# Altium project Arrow-ESC.PrjPcb
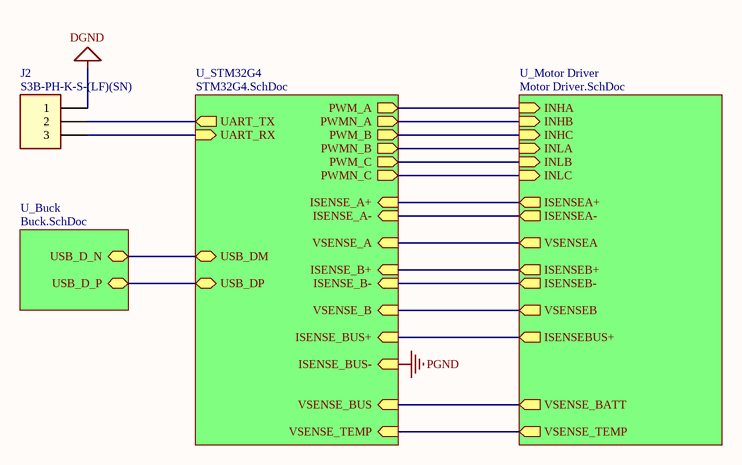
[diagram p0: Top Level.SchDoc]
4 sheets, 104 parts. Net scope: hierarchical (ports join the sheet entries above them; power ports are global).
Board file: Arrow-ESC.PcbDoc
Sheets:
  Top Level.SchDoc
    U_STM32G4 = STM32G4.SchDoc
    U_Buck = Buck.SchDoc
    U_Motor Driver = Motor Driver.SchDoc

## Sheet Top Level.SchDoc
size A; SheetNumber: 1; SheetTotal: 4

### Parts
J2  S3B-PH-K-S-(LF)(SN)  [CONN-TH_3P-P2.00_S3B-PH-K-S-LF-SN]

### Sub-sheets
U_Buck = Buck.SchDoc: USB_D_P (bidir), USB_D_N (bidir)
U_Motor Driver = Motor Driver.SchDoc: INHA (in), INHB (in), INHC (in), INLA (in), INLB (in), INLC (in), VSENSE_TEMP (out), ISENSEA+ (out), ISENSEA- (out), ISENSEB+ (out), ISENSEB- (out), VSENSEA (out), VSENSEB (out), VSENSE_BATT (out), ISENSEBUS+ (out)
U_STM32G4 = STM32G4.SchDoc: ISENSE_A+ (in), ISENSE_A- (in), ISENSE_B+ (in), ISENSE_B- (in), ISENSE_BUS+ (in), VSENSE_A (in), VSENSE_B (in), VSENSE_BUS (in), VSENSE_TEMP (in), UART_TX (out), UART_RX (in), USB_DP (bidir), USB_DM (bidir), PWM_A (out), PWMN_A (out), PWM_B (out), PWMN_B (out), PWM_C (out), PWMN_C (out), ISENSE_BUS- (in)

### Nets
DGND: J2.1
ADC1_IN10: sheet U_STM32G4/VSENSE_A, sheet U_Motor Driver/VSENSEA
ADC1_IN14: sheet U_STM32G4/VSENSE_BUS, sheet U_Motor Driver/VSENSE_BATT
ADC2_IN12: sheet U_STM32G4/VSENSE_B, sheet U_Motor Driver/VSENSEB
ADC2_IN17: sheet U_STM32G4/VSENSE_TEMP, sheet U_Motor Driver/VSENSE_TEMP
TIM1_CH1: sheet U_STM32G4/PWM_A, sheet U_Motor Driver/INHA
TIM1_CH1N: sheet U_STM32G4/PWMN_A, sheet U_Motor Driver/INHB
TIM1_CH2: sheet U_STM32G4/PWM_B, sheet U_Motor Driver/INHC
TIM1_CH2N: sheet U_STM32G4/PWMN_B, sheet U_Motor Driver/INLA
TIM1_CH3: sheet U_STM32G4/PWM_C, sheet U_Motor Driver/INLB
TIM1_CH3N: sheet U_STM32G4/PWMN_C, sheet U_Motor Driver/INLC
USART1_RX: J2.3 ; sheet U_STM32G4/UART_RX
USART1_TX: J2.2 ; sheet U_STM32G4/UART_TX
USB_D_N: sheet U_STM32G4/USB_DM, sheet U_Buck/USB_D_N
USB_D_P: sheet U_STM32G4/USB_DP, sheet U_Buck/USB_D_P
NetQ4_1: sheet U_STM32G4/ISENSE_A+, sheet U_Motor Driver/ISENSEA+
NetQ5_1: sheet U_STM32G4/ISENSE_B+, sheet U_Motor Driver/ISENSEB+
NetQ6_1: sheet U_STM32G4/ISENSE_A-, sheet U_STM32G4/ISENSE_B-, sheet U_STM32G4/ISENSE_BUS+, sheet U_Motor Driver/ISENSEA-, sheet U_Motor Driver/ISENSEB-, sheet U_Motor Driver/ISENSEBUS+

### Library data of the parts
J2 = S3B-PH-K-S-(LF)(SN): 3P 1x3P PH Tin -25℃~+85℃ White 2mm 100V 3 2A 1 Right Angle Through Hole,Right Angle,P=2mm Headers, Male Pins RoHS; Manu Part #: S3B-PH-K-S-(LF)(SN); LCSC Part #: C157929

## Sheet STM32G4.SchDoc
size B; SheetNumber: 2; SheetTotal: 4
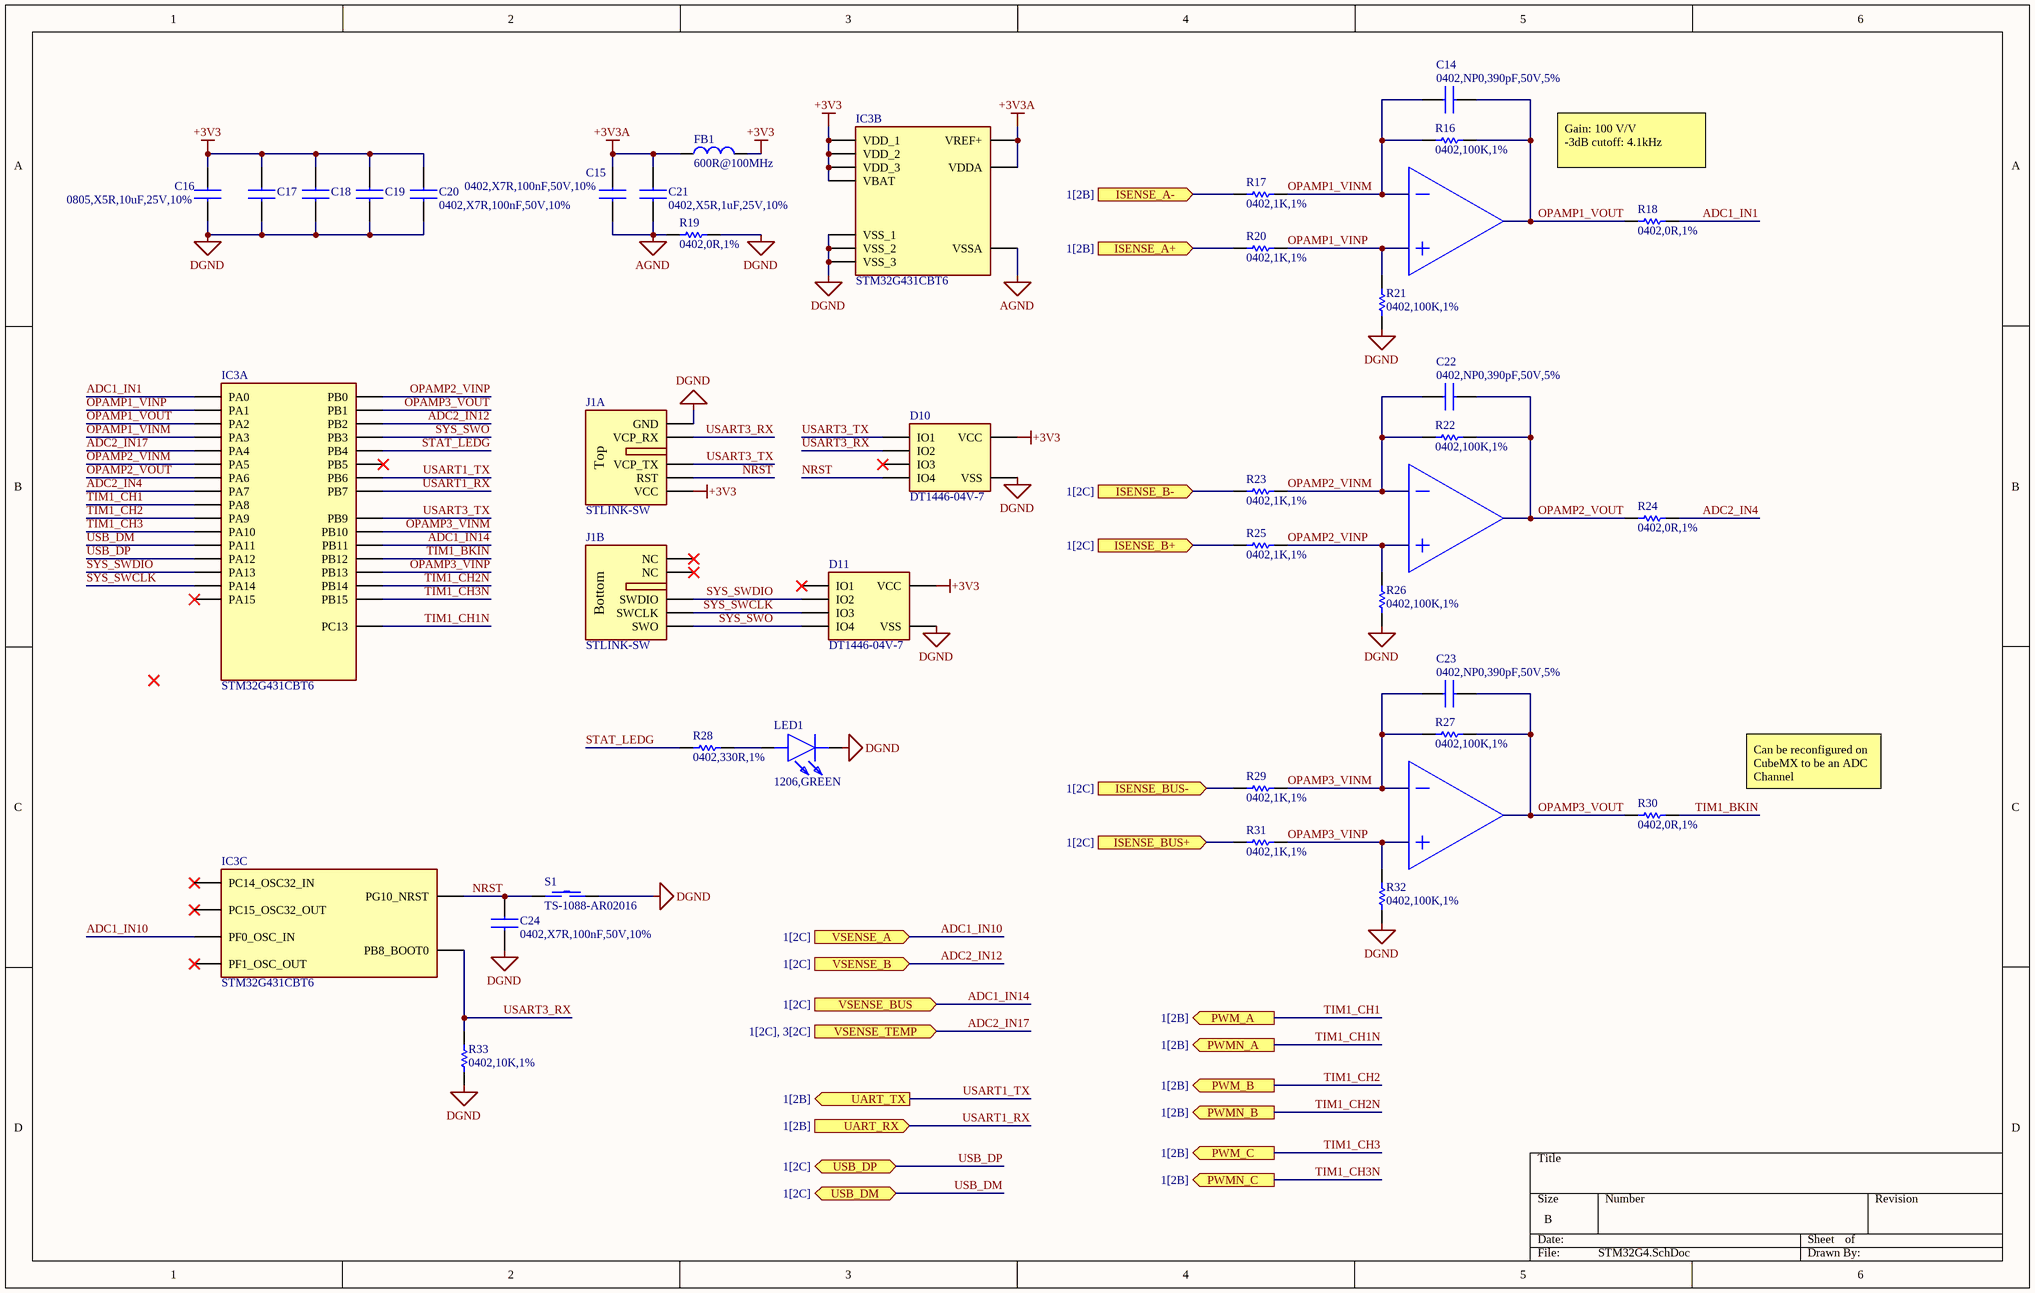
[diagram p1: STM32G4.SchDoc]

### Parts
C14  0402,NP0,390pF,50V,5%  [CAPC1005X55N]
C15  0402,X7R,100nF,50V,10%  [CAPC1005X55N]
C16  0805,X5R,10uF,25V,10%  [CAPC2012X145N]
C17  0402,X7R,100nF,50V,10%  [CAPC1005X55N]  (value not drawn)
C18  0402,X7R,100nF,50V,10%  [CAPC1005X55N]  (value not drawn)
C19  0402,X7R,100nF,50V,10%  [CAPC1005X55N]  (value not drawn)
C20  0402,X7R,100nF,50V,10%  [CAPC1005X55N]
C21  0402,X5R,1uF,25V,10%  [CAPC1005X55N]
C22  0402,NP0,390pF,50V,5%  [CAPC1005X55N]
C23  0402,NP0,390pF,50V,5%  [CAPC1005X55N]
C24  0402,X7R,100nF,50V,10%  [CAPC1005X55N]
D10  DT1446-04V-7  [SOTFL50P162X60-6N]
D11  DT1446-04V-7  [SOTFL50P162X60-6N]
FB1  600R@100MHz  [L0603]
IC3  STM32G431CBT6  [QFP50P900X900X160-48N]  (parts A,B,C of 3)
J1  STLINK-SW  [009159010061911]  (parts A,B of 2)  (no BOM)
LED1  1206,GREEN  [LEDC3216X120N]
R16  0402,100K,1%  [RESC1005X40N]
R17  0402,1K,1%  [RESC1005X40N]
R18  0402,0R,1%  [RESC1005X40N]
R19  0402,0R,1%  [RESC1005X40N]
R20  0402,1K,1%  [RESC1005X40N]
R21  0402,100K,1%  [RESC1005X40N]
R22  0402,100K,1%  [RESC1005X40N]
R23  0402,1K,1%  [RESC1005X40N]
R24  0402,0R,1%  [RESC1005X40N]
R25  0402,1K,1%  [RESC1005X40N]
R26  0402,100K,1%  [RESC1005X40N]
R27  0402,100K,1%  [RESC1005X40N]
R28  0402,330R,1%  [RESC1005X40N]
R29  0402,1K,1%  [RESC1005X40N]
R30  0402,0R,1%  [RESC1005X40N]
R31  0402,1K,1%  [RESC1005X40N]
R32  0402,100K,1%  [RESC1005X40N]
R33  0402,10K,1%  [RESC1005X40N]
S1  TS-1088-AR02016  [SW-SMD_L3.9-W3.0-P4.45]

### Ports
ISENSE_A+ (in, see 1[2B]), ISENSE_A- (in, see 1[2B]), ISENSE_B+ (in, see 1[2C]), ISENSE_B- (in, see 1[2C]), ISENSE_BUS+ (in, see 1[2C]), ISENSE_BUS- (in, see 1[2C]), PWM_A (out, see 1[2B]), PWM_B (out, see 1[2B]), PWM_C (out, see 1[2B]), PWMN_A (out, see 1[2B]), PWMN_B (out, see 1[2B]), PWMN_C (out, see 1[2B]), UART_RX (in, see 1[2B]), UART_TX (out, see 1[2B]), USB_DM (bidir, see 1[2C]), USB_DP (bidir, see 1[2C]), VSENSE_A (in, see 1[2C]), VSENSE_B (in, see 1[2C]), VSENSE_BUS (in, see 1[2C]), VSENSE_TEMP (in, see 1[2C], 3[2C])

### Nets
+3V3: C16.2 C17.2 C18.2 C19.2 C20.2 D10.5(VCC) D11.5(VCC) FB1.2 IC3.1(VBAT) IC3.24(VDD_1) IC3.36(VDD_2) IC3.48(VDD_3) J1.5(VCC)
+3V3A: C15.2 C21.2 FB1.1 IC3.20(VREF+) IC3.21(VDDA)
AGND: C15.1 C21.1 IC3.19(VSSA) R19.1
DGND: C16.1 C17.1 C18.1 C19.1 C20.1 C24.1 D10.2(VSS) D11.2(VSS) IC3.23(VSS_1) IC3.35(VSS_2) IC3.47(VSS_3) J1.1(GND) LED1.1(K) R19.2 R21.1 R26.1 R32.1 R33.1 S1.1
PGND: R29.1 ; port ISENSE_BUS-
ADC1_IN1: IC3.8(PA0) R18.2
ADC1_IN10: IC3.5(PF0_OSC_IN) ; port VSENSE_A
ADC1_IN14: IC3.25(PB11) ; port VSENSE_BUS
ADC2_IN4: IC3.15(PA7) R24.2
ADC2_IN12: IC3.18(PB2) ; port VSENSE_B
ADC2_IN17: IC3.12(PA4) ; port VSENSE_TEMP
NRST: C24.2 D10.6(IO4) IC3.7(PG10_NRST) J1.4(RST) S1.2
OPAMP1_VINM: C14.1 IC3.11(PA3) R16.2 R17.2
OPAMP1_VINP: IC3.9(PA1) R20.2 R21.2
OPAMP1_VOUT: C14.2 IC3.10(PA2) R16.1 R18.1
OPAMP2_VINM: C22.1 IC3.13(PA5) R22.2 R23.2
OPAMP2_VINP: IC3.16(PB0) R25.2 R26.2
OPAMP2_VOUT: C22.2 IC3.14(PA6) R22.1 R24.1
OPAMP3_VINM: C23.1 IC3.22(PB10) R27.1 R29.2
OPAMP3_VINP: IC3.27(PB13) R31.2 R32.2
OPAMP3_VOUT: C23.2 IC3.17(PB1) R27.2 R30.1
STAT_LEDG: IC3.41(PB4) R28.1
SYS_SWCLK: D11.4(IO3) IC3.38(PA14) J1.9(SWCLK)
SYS_SWDIO: D11.3(IO2) IC3.37(PA13) J1.8(SWDIO)
SYS_SWO: D11.6(IO4) IC3.40(PB3) J1.10(SWO)
TIM1_BKIN: IC3.26(PB12) R30.2
TIM1_CH1: IC3.30(PA8) ; port PWM_A
TIM1_CH1N: IC3.2(PC13) ; port PWMN_A
TIM1_CH2: IC3.31(PA9) ; port PWM_B
TIM1_CH2N: IC3.28(PB14) ; port PWMN_B
TIM1_CH3: IC3.32(PA10) ; port PWM_C
TIM1_CH3N: IC3.29(PB15) ; port PWMN_C
USART1_RX: IC3.44(PB7) ; port UART_RX
USART1_TX: IC3.43(PB6) ; port UART_TX
USART3_RX: D10.3(IO2) IC3.45(PB8_BOOT0) J1.2(VCP_RX) R33.2
USART3_TX: D10.1(IO1) IC3.46(PB9) J1.3(VCP_TX)
USB_DM: IC3.33(PA11) ; port USB_DM  [project net USB_D_N]
USB_DP: IC3.34(PA12) ; port USB_DP  [project net USB_D_P]
NetLED1_2: LED1.2(A) R28.2
NetQ4_1: R20.1 ; port ISENSE_A+
NetQ5_1: R25.1 ; port ISENSE_B+
NetQ6_1: R17.1 R23.1 R31.1 ; port ISENSE_A-, port ISENSE_B-, port ISENSE_BUS+

Not connected (* = marked no-connect by the designer): D10 4(IO3)*; D11 1(IO1)*; IC3 3(PC14_OSC32_IN)* 4(PC15_OSC32_OUT)* 6(PF1_OSC_OUT)* 39(PA15)* 42(PB5)*; J1 6(NC)* 7(NC)*

### Notes on the sheet
- Gain: 100 V/V
  -3dB cutoff: 4.1kHz
- Can be reconfigured on CubeMX to be an ADC Channel
- (in symbol STLINK-SW, part A) Top
- (in symbol STLINK-SW, part B) Bottom

### Library data of the parts
C14 C22 C23 = CC0402JRNPO9BN391: 390 pF ±5% 50V Ceramic Capacitor C0G, NP0 0402 (1005 Metric); Manufacturer_Name: YAGEO; Manufacturer_Part_Number: CC0402KRX7R9BB104; Datasheet Link: https://4donline.ihs.com/images/VipMasterIC/IC/YAGO/YAGO-S-A0003557223/YAGO-S-A0003557223-1.pdf?hkey=6D3A4C79FDBF58556ACFDE234799DDF0; Height: 0.55mm; Mouser Part Number: 603-CC402KRX7R9BB104; Mouser Price/Stock: https://www.mouser.co.uk/ProductDetail/YAGEO/CC0402KRX7R9BB104?qs=vRUrOTOuwyGrQb4GbTIVjw%3D%3D; Arrow Part Number: CC0402KRX7R9BB104; Arrow Price/Stock: https://www.arrow.com/en/products/cc0402krx7r9bb104/yageo?utm_currency=USD&region=europe; Manu Part #: CC0402JRNPO9BN391; LCSC Part #: C282239
C15 C17-C20 C24 = CC0402KRX7R9BB104: 0.1 µF ±10% 50V Ceramic Capacitor X7R 0402 (1005 Metric); Manufacturer_Name: YAGEO; Datasheet Link: https://4donline.ihs.com/images/VipMasterIC/IC/YAGO/YAGO-S-A0003557223/YAGO-S-A0003557223-1.pdf?hkey=6D3A4C79FDBF58556ACFDE234799DDF0; Height: 0.55mm; Manufacturer_Part_Number: CC0402KRX7R9BB104; Mouser Part Number: 603-CC402KRX7R9BB104; Mouser Price/Stock: https://www.mouser.co.uk/ProductDetail/YAGEO/CC0402KRX7R9BB104?qs=vRUrOTOuwyGrQb4GbTIVjw%3D%3D; Arrow Part Number: CC0402KRX7R9BB104; Arrow Price/Stock: https://www.arrow.com/en/products/cc0402krx7r9bb104/yageo?utm_currency=USD&region=europe; Manu Part #: CC0402KRX7R9BB104; LCSC Part #: C131394
C16 = CC0805KKX5R8BB106: 10 µF ±10% 25V Ceramic Capacitor X5R 0805 (2012 Metric); Manufacturer_Name: YAGEO; Datasheet Link: https://www.yageo.com/upload/media/product/productsearch/datasheet/mlcc/UPY-GPHC_X5R_4V-to-50V_27.pdf; Height: 1.45mm; Manufacturer_Part_Number: CC0805KKX5R8BB106; Mouser Part Number: 603-CC805KKX5R8BB106; Mouser Price/Stock: https://www.mouser.co.uk/ProductDetail/YAGEO/CC0805KKX5R8BB106?qs=57cj7OiSijm89pM64t1AGQ%3D%3D; Arrow Part Number: CC0805KKX5R8BB106; Arrow Price/Stock: https://www.arrow.com/en/products/cc0805kkx5r8bb106/yageo?utm_currency=USD&region=nac; LCSC Part #: C89831
C21 = CC0402KRX5R8BB105: 1 µF ±10% 25V Ceramic Capacitor X5R 0402 (1005 Metric); Manufacturer_Name: YAGEO; Manufacturer_Part_Number: CC0402KRX7R9BB104; Datasheet Link: https://4donline.ihs.com/images/VipMasterIC/IC/YAGO/YAGO-S-A0003557223/YAGO-S-A0003557223-1.pdf?hkey=6D3A4C79FDBF58556ACFDE234799DDF0; Height: 0.55mm; Mouser Part Number: 603-CC402KRX7R9BB104; Mouser Price/Stock: https://www.mouser.co.uk/ProductDetail/YAGEO/CC0402KRX7R9BB104?qs=vRUrOTOuwyGrQb4GbTIVjw%3D%3D; Arrow Part Number: CC0402KRX7R9BB104; Arrow Price/Stock: https://www.arrow.com/en/products/cc0402krx7r9bb104/yageo?utm_currency=USD&region=europe; Manu Part #: CC0402KRX5R8BB105; LCSC Part #: C326568
D10 D11 = DT1446-04V-7: 8.5V Clamp 4.7A (8/20µs) Ipp Tvs Diode Surface Mount SOT-563; Manufacturer_Name: Diodes Incorporated; Datasheet Link: https://www.diodes.com//assets/Datasheets/DT1446-04V.pdf; Height: 0.6mm; Manufacturer_Part_Number: DT1446-04V-7; Mouser Part Number: 621-DT1446-04V-7; Mouser Price/Stock: https://www.mouser.co.uk/ProductDetail/Diodes-Incorporated/DT1446-04V-7?qs=5V6w%252Be2aIqaQkUd2yRdmdA%3D%3D; Arrow Part Number: DT1446-04V-7; Arrow Price/Stock: https://www.arrow.com/en/products/dt1446-04v-7/diodes-incorporated; Manu Part #: DT1446-04V-7; LCSC Part #: C460066
FB1 = BLM18AG601SN1D: 380mΩ ±25% 600Ω@100MHz 0603 Ferrite Beads ROHS; LCSC Part #: C19330
IC3 = STM32G431CBT6: Arm Cortex-M4 32-bit MCU+FPU, 170 MHz / 213 DMIPS, up to 128 KB Flash, 32 KB SRAM, rich analog, math accelerator; Manufacturer_Name: STMicroelectronics; Datasheet Link: https://www.st.com/resource/en/datasheet/stm32g431cb.pdf; Height: 1.6mm; Manufacturer_Part_Number: STM32G431CBT6; Mouser Part Number: 511-STM32G431CBT6; Mouser Price/Stock: https://www.mouser.co.uk/ProductDetail/STMicroelectronics/STM32G431CBT6?qs=T3oQrply3y8OocyGDXq5wg%3D%3D; Arrow Part Number: STM32G431CBT6; Arrow Price/Stock: https://www.arrow.com/en/products/stm32g431cbt6/stmicroelectronics?utm_currency=USD&region=nac; LCSC Part #: C529355
J1 = STLINK-SW: SSL Connector 10 Position Adapter, Bridge Board to Board - Card Edge 0.079" (2.00mm)
LED1 = LTST-C150KGKT: 20mA 44.5mcd Water Clear -55℃~+85℃ 571nm Yellow Green 130° 75mW 2V 1206 LED Indication - Discrete ROHS; Manufacturer_Name: Lite-On; Datasheet Link: http://optoelectronics.liteon.com/upload/download/ds22-2000-072/ltst-c150kgkt.pdf; Height: 1.2mm; Manufacturer_Part_Number: LTST-C150KGKT; Mouser Part Number: 859-LTST-C150KGKT; Mouser Price/Stock: https://www.mouser.co.uk/ProductDetail/Lite-On/LTST-C150KGKT?qs=G7lFeYdtIHB%2FzaFKBwEyXw%3D%3D; Arrow Part Number: LTST-C150KGKT; Arrow Price/Stock: https://www.arrow.com/en/products/ltst-c150kgkt/lite-on-technology?utm_currency=USD&region=nac; LCSC Part #: C125085; Manu Part #: LTST-C150KGKT
R16 R21 R22 R26 R27 R32 = RC0402FR-07100KL: 100 kOhms ±1% 0.063W, 1/16W Chip Resistor 0402 (1005 Metric) Moisture Resistant Thick Film; Manufacturer_Name: YAGEO; Manufacturer_Part_Number: RC0402FR-0710KL; Datasheet Link: https://componentsearchengine.com/Datasheets/2/RC0402FR-0710KL.pdf; Height: 0.4mm; Mouser Part Number: 603-RC0402FR-0710KL; Mouser Price/Stock: https://www.mouser.co.uk/ProductDetail/YAGEO/RC0402FR-0710KL?qs=I1mnnYJTTsxUoNwrUsQExA%3D%3D; Arrow Part Number: RC0402FR-0710KL; Arrow Price/Stock: https://www.arrow.com/en/products/rc0402fr-0710kl/yageo?region=europe; Manu Part #: RC0402FR-07100KL; LCSC Part #: C60491
R17 R20 R23 R25 R29 R31 = RC0402FR-071KL: 1 kOhms ±1% 0.063W, 1/16W Chip Resistor 0402 (1005 Metric) Moisture Resistant Thick Film; Manufacturer_Name: YAGEO; Manufacturer_Part_Number: RC0402FR-0710KL; Datasheet Link: https://componentsearchengine.com/Datasheets/2/RC0402FR-0710KL.pdf; Height: 0.4mm; Mouser Part Number: 603-RC0402FR-0710KL; Mouser Price/Stock: https://www.mouser.co.uk/ProductDetail/YAGEO/RC0402FR-0710KL?qs=I1mnnYJTTsxUoNwrUsQExA%3D%3D; Arrow Part Number: RC0402FR-0710KL; Arrow Price/Stock: https://www.arrow.com/en/products/rc0402fr-0710kl/yageo?region=europe; Manu Part #: RC0402FR-071KL; LCSC Part #: C106235
R18 R19 R24 R30 = RC0402FR-070RL: 0 Ohms Jumper Chip Resistor 0402 (1005 Metric) Moisture Resistant Thick Film; Manufacturer_Name: YAGEO; Manufacturer_Part_Number: RC0402FR-0710KL; Datasheet Link: https://componentsearchengine.com/Datasheets/2/RC0402FR-0710KL.pdf; Height: 0.4mm; Mouser Part Number: 603-RC0402FR-0710KL; Mouser Price/Stock: https://www.mouser.co.uk/ProductDetail/YAGEO/RC0402FR-0710KL?qs=I1mnnYJTTsxUoNwrUsQExA%3D%3D; Arrow Part Number: RC0402FR-0710KL; Arrow Price/Stock: https://www.arrow.com/en/products/rc0402fr-0710kl/yageo?region=europe; Manu Part #: RC0402FR-070RL; LCSC Part #: C106231
R28 = RC0402FR-07330RL: 330 Ohms ±1% 0.063W, 1/16W Chip Resistor 0402 (1005 Metric) Moisture Resistant Thick Film; Manufacturer_Name: YAGEO; Manufacturer_Part_Number: RC0402FR-0710KL; Datasheet Link: https://componentsearchengine.com/Datasheets/2/RC0402FR-0710KL.pdf; Height: 0.4mm; Mouser Part Number: 603-RC0402FR-0710KL; Mouser Price/Stock: https://www.mouser.co.uk/ProductDetail/YAGEO/RC0402FR-0710KL?qs=I1mnnYJTTsxUoNwrUsQExA%3D%3D; Arrow Part Number: RC0402FR-0710KL; Arrow Price/Stock: https://www.arrow.com/en/products/rc0402fr-0710kl/yageo?region=europe; Manu Part #: RC0402FR-07330RL; LCSC Part #: C105875
R33 = RC0402FR-0710KL: 10 kOhms ±1% 0.063W, 1/16W Chip Resistor 0402 (1005 Metric) Moisture Resistant Thick Film; Manufacturer_Name: YAGEO; Datasheet Link: https://componentsearchengine.com/Datasheets/2/RC0402FR-0710KL.pdf; Height: 0.4mm; Manufacturer_Part_Number: RC0402FR-0710KL; Mouser Part Number: 603-RC0402FR-0710KL; Mouser Price/Stock: https://www.mouser.co.uk/ProductDetail/YAGEO/RC0402FR-0710KL?qs=I1mnnYJTTsxUoNwrUsQExA%3D%3D; Arrow Part Number: RC0402FR-0710KL; Arrow Price/Stock: https://www.arrow.com/en/products/rc0402fr-0710kl/yageo?region=europe
S1 = TS-1088-AR02016: Without Bracket 50mA 4mm 100,000 Cycles 12V 1.6N 3mm 2mm Round Button Surface Mount,Vertical SPST SMD Tactile Switches ROHS; LCSC Part #: C720477; Manu Part #: TS-1088-AR02016

## Sheet Buck.SchDoc
size A; SheetNumber: 4; SheetTotal: 4
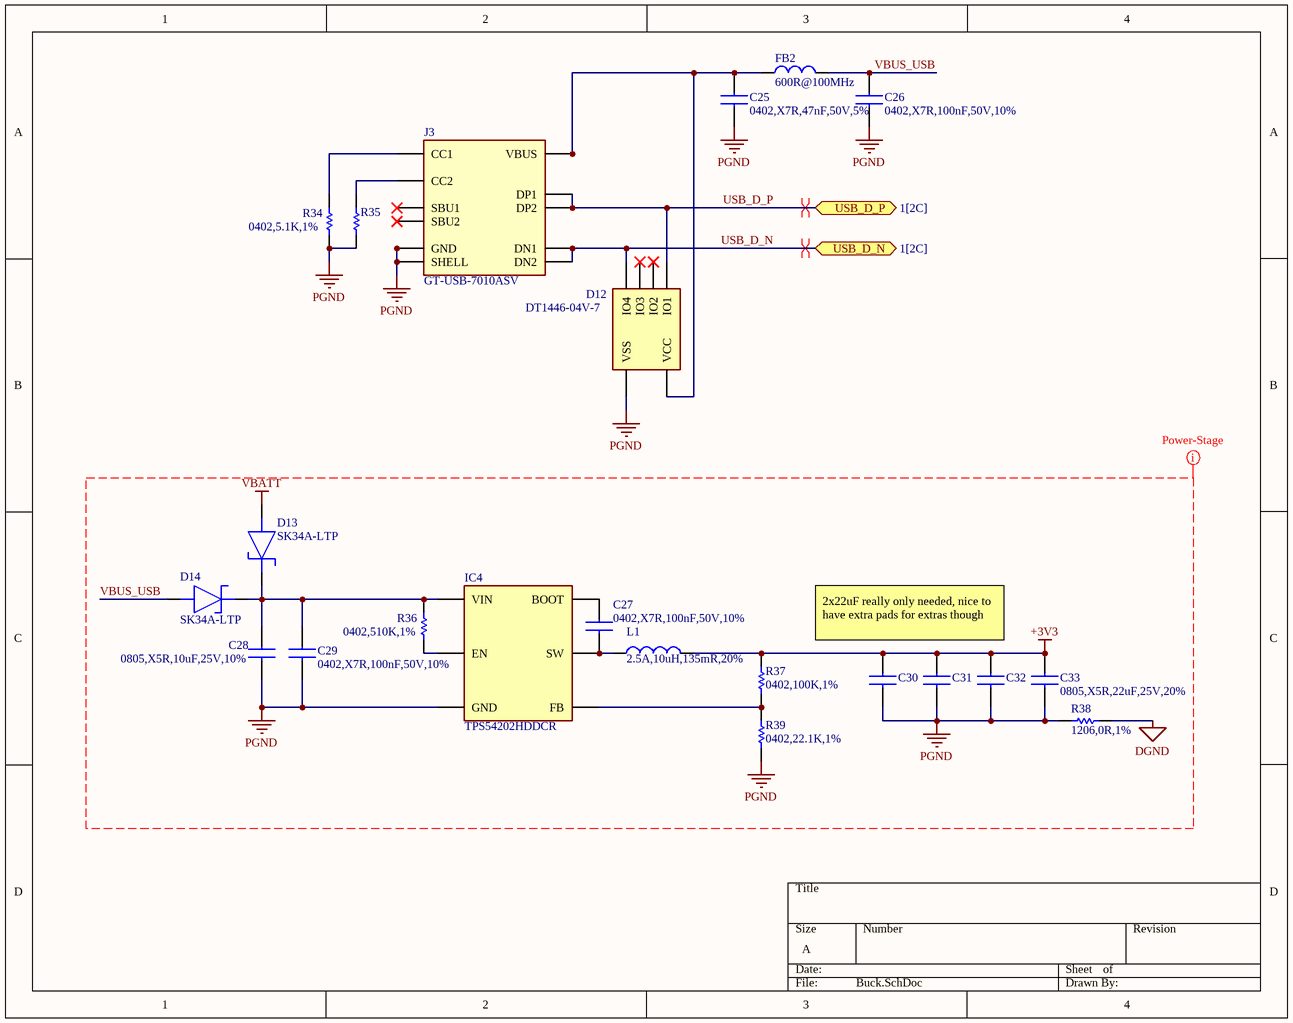
[diagram p2: Buck.SchDoc]

### Parts
C25  0402,X7R,47nF,50V,5%  [CAPC1005X55N]
C26  0402,X7R,100nF,50V,10%  [CAPC1005X55N]
C27  0402,X7R,100nF,50V,10%  [CAPC1005X55N]
C28  0805,X5R,10uF,25V,10%  [CAPC2012X145N]
C29  0402,X7R,100nF,50V,10%  [CAPC1005X55N]
C30  0805,X5R,22uF,25V,20%  [CAPC2012X145N]  (value not drawn)
C31  0805,X5R,22uF,25V,20%  [CAPC2012X145N]  (value not drawn)
C32  0805,X5R,22uF,25V,20%  [CAPC2012X145N]  (value not drawn)
C33  0805,X5R,22uF,25V,20%  [CAPC2012X145N]
D12  DT1446-04V-7  [SOTFL50P162X60-6N]
D13  SK34A-LTP  [SK34ALTP]
D14  SK34A-LTP  [SK34ALTP]
FB2  600R@100MHz  [L0603]
IC4  TPS54202HDDCR  [SOT95P280X100-6N]
J3  GT-USB-7010ASV  [USB-C-SMD_G-SWITCH_GT-USB-7010ASV]
L1  2.5A,10uH,135mR,20%  [IND-SMD_L3.0-W3.0_FTC303020D]
R34  0402,5.1K,1%  [RESC1005X40N]
R35  0402,5.1K,1%  [RESC1005X40N]  (value not drawn)
R36  0402,510K,1%  [RESC1005X40N]
R37  0402,100K,1%  [RESC1005X40N]
R38  1206,0R,1%  [RESC3116X65N]
R39  0402,22.1K,1%  [RESC1005X40N]

### Ports
USB_D_N (bidir, see 1[2C]), USB_D_P (bidir, see 1[2C])

### Nets
+3V3: C30.2 C31.2 C32.2 C33.2 L1.2 R37.2
DGND: R38.2
PGND: C25.1 C26.1 C28.1 C29.1 C30.1 C31.1 C32.1 C33.1 D12.2(VSS) IC4.1(GND) J3.1(SHELL) J3.2(SHELL) J3.3(SHELL) J3.4(SHELL) J3.A1B12(GND) J3.B1A12(GND) R34.1 R35.1 R38.1 R39.1
VBATT: D13.2(A)
USB_D_N: D12.6(IO4) J3.A7(DN1) J3.B7(DN2) ; port USB_D_N
USB_D_P: D12.1(IO1) J3.A6(DP1) J3.B6(DP2) ; port USB_D_P
VBUS_USB: C26.2 D14.2(A) FB2.2
NetC25_2: C25.2 D12.5(VCC) FB2.1 J3.A4B9(VBUS) J3.B4A9(VBUS)
NetC27_1: C27.1 IC4.2(SW) L1.1
NetC27_2: C27.2 IC4.6(BOOT)
NetC28_2: C28.2 C29.2 D13.1(K) D14.1(K) IC4.3(VIN) R36.2
NetIC4_4: IC4.4(FB) R37.1 R39.2
NetIC4_5: IC4.5(EN) R36.1
NetJ3_A5: J3.A5(CC1) R34.2
NetJ3_B5: J3.B5(CC2) R35.2

Not connected (* = marked no-connect by the designer): D12 3(IO2)* 4(IO3)*; J3 A8(SBU1)* B8(SBU2)*

### Layout directives
differential pair: USB_D_N, USB_D_P
CompClassName: Power-Stage: +3V3, DGND, PGND, VBATT, VBUS_USB

### Notes on the sheet
- 2x22uF really only needed, nice to have extra pads for extras though

### Library data of the parts
C25 = CC0402JRX7R9BB473: 0.047 µF ±5% 50V Ceramic Capacitor X7R 0402 (1005 Metric); Manufacturer_Name: YAGEO; Datasheet Link: https://4donline.ihs.com/images/VipMasterIC/IC/YAGO/YAGO-S-A0003557223/YAGO-S-A0003557223-1.pdf?hkey=6D3A4C79FDBF58556ACFDE234799DDF0; Height: 0.55mm; Manufacturer_Part_Number: CC0402JRX7R9BB473; Mouser Part Number: 603-CC402KRX7R9BB104; Mouser Price/Stock: https://www.mouser.co.uk/ProductDetail/YAGEO/CC0402KRX7R9BB104?qs=vRUrOTOuwyGrQb4GbTIVjw%3D%3D; Arrow Part Number: CC0402KRX7R9BB104; Arrow Price/Stock: https://www.arrow.com/en/products/cc0402krx7r9bb104/yageo?utm_currency=USD&region=europe; Manu Part #: CC0402JRX7R9BB473; LCSC Part #: C576715
C26 C27 C29 = CC0402KRX7R9BB104: as C15 on sheet STM32G4; Datasheet Link: https://4donline.ihs.com/images/VipMasterIC/IC/YAGO/YAGO-S-A0003557223/YAGO-S-A0003557223-1.pdf?hkey=6D3A4C79FDBF58556ACFDE234799DDF0; Height: 0.55mm; Manufacturer_Part_Number: CC0402KRX7R9BB104; Mouser Part Number: 603-CC402KRX7R9BB104; Mouser Price/Stock: https://www.mouser.co.uk/ProductDetail/YAGEO/CC0402KRX7R9BB104?qs=vRUrOTOuwyGrQb4GbTIVjw%3D%3D; Arrow Part Number: CC0402KRX7R9BB104; Arrow Price/Stock: https://www.arrow.com/en/products/cc0402krx7r9bb104/yageo?utm_currency=USD&region=europe; Manu Part #: CC0402KRX7R9BB104; LCSC Part #: C131394
C28 = CC0805KKX5R8BB106: as C16 on sheet STM32G4; Datasheet Link: https://www.yageo.com/upload/media/product/productsearch/datasheet/mlcc/UPY-GPHC_X5R_4V-to-50V_27.pdf; Height: 1.45mm; Manufacturer_Part_Number: CC0805KKX5R8BB106; Mouser Part Number: 603-CC805KKX5R8BB106; Mouser Price/Stock: https://www.mouser.co.uk/ProductDetail/YAGEO/CC0805KKX5R8BB106?qs=57cj7OiSijm89pM64t1AGQ%3D%3D; Arrow Part Number: CC0805KKX5R8BB106; Arrow Price/Stock: https://www.arrow.com/en/products/cc0805kkx5r8bb106/yageo?utm_currency=USD&region=nac; LCSC Part #: C89831
C30-C33 = CC0805MKX5R8BB226: 25V 22uF X5R ±20% 0805 Ceramic Capacitors RoHS; Manufacturer_Name: YAGEO; Datasheet Link: https://www.yageo.com/upload/media/product/productsearch/datasheet/mlcc/UPY-GPHC_X5R_4V-to-50V_27.pdf; Height: 1.45mm; Manufacturer_Part_Number: CC0805MKX5R8BB226; Mouser Part Number: 603-CC805KKX5R8BB106; Mouser Price/Stock: https://www.mouser.co.uk/ProductDetail/YAGEO/CC0805KKX5R8BB106?qs=57cj7OiSijm89pM64t1AGQ%3D%3D; Arrow Part Number: CC0805KKX5R8BB106; Arrow Price/Stock: https://www.arrow.com/en/products/cc0805kkx5r8bb106/yageo?utm_currency=USD&region=nac; LCSC Part #: C784585
D12 = DT1446-04V-7: as D10 on sheet STM32G4; Datasheet Link: https://www.diodes.com//assets/Datasheets/DT1446-04V.pdf; Height: 0.6mm; Manufacturer_Part_Number: DT1446-04V-7; Mouser Part Number: 621-DT1446-04V-7; Mouser Price/Stock: https://www.mouser.co.uk/ProductDetail/Diodes-Incorporated/DT1446-04V-7?qs=5V6w%252Be2aIqaQkUd2yRdmdA%3D%3D; Arrow Part Number: DT1446-04V-7; Arrow Price/Stock: https://www.arrow.com/en/products/dt1446-04v-7/diodes-incorporated; Manu Part #: DT1446-04V-7; LCSC Part #: C460066
D13 D14 = SK34A-LTP: 80A 40V 500mV@3A 3A SMA(DO-214AC) Single Diodes RoHS; Manufacturer_Name: MCC; Datasheet Link: https://mccsemi.com/pdf/Products/SK32A-L-SK310A-L(DO-214AC).pdf; Height: 2.44mm; Manufacturer_Part_Number: SK34A-LTP; Mouser Part Number: 833-SK34A-LTP; Mouser Price/Stock: https://www.mouser.co.uk/ProductDetail/Micro-Commercial-Components-MCC/SK34A-LTP?qs=JeAkOuORR2VPwzg48d%252BVAA%3D%3D; Arrow Part Number: SK34A-LTP; Arrow Price/Stock: https://www.arrow.com/en/products/sk34a-ltp/micro-commercial-components?utm_currency=USD&region=nac; Manu Part #: SK34A-LTP; LCSC Part #: C85269
FB2 = BLM18AG601SN1D: as FB1 on sheet STM32G4; LCSC Part #: C19330
IC4 = TPS54202HDDCR: 500kHz 2A Buck Adjustable 596mV~28V 1 TSOT-23-6 Voltage Regulators - DC DC Switching Regulators RoHS; Manufacturer_Name: Texas Instruments; Datasheet Link: http://www.ti.com/lit/gpn/tps54202h; Height: 1.1mm; Manufacturer_Part_Number: TPS54202HDDCR; Mouser Part Number: 595-TPS54202HDDCR; Mouser Price/Stock: https://www.mouser.co.uk/ProductDetail/Texas-Instruments/TPS54202HDDCR?qs=uP22XH7NdCtzy%252BOdxI8qhQ%3D%3D; Arrow Part Number: TPS54202HDDCR; Arrow Price/Stock: https://www.arrow.com/en/products/tps54202hddcr/texas-instruments?utm_currency=USD&region=europe; Manu Part #: TPS54202HDDCR; LCSC Part #: C527684
J3 = GT-USB-7010ASV: USB 2.0 3A 1 Surface Mount, Right Angle 16P Female -40℃~+85℃ Type-C SMD USB Connectors ROHS; LCSC Part #: C2988369; Manu Part #: GT-USB-7010ASV
L1 = FTC303020D100MBCA: 2.5A 10uH ±20% 3.8A 135mΩ SMD,3x3mm Fixed Inductors RoHS; Manu Part #: FTC303020D100MBCA; LCSC Part #: C7423323
R34 R35 = RC0402FR-075K1L: 5.1 kOhms ±1% 0.063W, 1/16W Chip Resistor 0402 (1005 Metric) Moisture Resistant Thick Film; Manufacturer_Name: YAGEO; Manufacturer_Part_Number: RC0402FR-0710KL; Datasheet Link: https://componentsearchengine.com/Datasheets/2/RC0402FR-0710KL.pdf; Height: 0.4mm; Mouser Part Number: 603-RC0402FR-0710KL; Mouser Price/Stock: https://www.mouser.co.uk/ProductDetail/YAGEO/RC0402FR-0710KL?qs=I1mnnYJTTsxUoNwrUsQExA%3D%3D; Arrow Part Number: RC0402FR-0710KL; Arrow Price/Stock: https://www.arrow.com/en/products/rc0402fr-0710kl/yageo?region=europe; Manu Part #: RC0402FR-075K1L; LCSC Part #: C105872
R36 = RC0402FR-07510KL: 510 kOhms ±1% 0.063W, 1/16W Chip Resistor 0402 (1005 Metric) Moisture Resistant Thick Film; Manufacturer_Name: YAGEO; Manufacturer_Part_Number: RC0402FR-0710KL; Datasheet Link: https://componentsearchengine.com/Datasheets/2/RC0402FR-0710KL.pdf; Height: 0.4mm; Mouser Part Number: 603-RC0402FR-0710KL; Mouser Price/Stock: https://www.mouser.co.uk/ProductDetail/YAGEO/RC0402FR-0710KL?qs=I1mnnYJTTsxUoNwrUsQExA%3D%3D; Arrow Part Number: RC0402FR-0710KL; Arrow Price/Stock: https://www.arrow.com/en/products/rc0402fr-0710kl/yageo?region=europe; Manu Part #: RC0402FR-07510KL; LCSC Part #: C137961
R37 = RC0402FR-07100KL: as R16 on sheet STM32G4; Datasheet Link: https://componentsearchengine.com/Datasheets/2/RC0402FR-0710KL.pdf; Height: 0.4mm; Mouser Part Number: 603-RC0402FR-0710KL; Mouser Price/Stock: https://www.mouser.co.uk/ProductDetail/YAGEO/RC0402FR-0710KL?qs=I1mnnYJTTsxUoNwrUsQExA%3D%3D; Arrow Part Number: RC0402FR-0710KL; Arrow Price/Stock: https://www.arrow.com/en/products/rc0402fr-0710kl/yageo?region=europe; Manu Part #: RC0402FR-07100KL; LCSC Part #: C60491
R38 = RC1206FR-070RL: 0Ω 250mW 200V Thick Film Resistor ±1% 1206 Chip Resistor - Surface Mount RoHS; Manufacturer_Name: YAGEO; Datasheet Link: https://www.yageogroup.com/content/datasheet/asset/file/PYU-RC_GROUP_51_ROHS_L; Height: 0.65mm; Manufacturer_Part_Number: RC1206FR-070RL; Mouser Part Number: 603-RC1206FR-070RL; Mouser Price/Stock: https://www.mouser.co.uk/ProductDetail/YAGEO/RC1206FR-070RL?qs=%2FbpERZPLKKvgeF8VBtNQLg%3D%3D; Arrow Part Number: RC1206FR-070RL; Arrow Price/Stock: https://www.arrow.com/en/products/rc1206fr-070rl/yageo?region=nac; Manu Part #: RC1206FR-070RL; LCSC Part #: C137394
R39 = RC0402FR-0722K1L: 22.1 kOhms ±1% 0.063W, 1/16W Chip Resistor 0402 (1005 Metric) Moisture Resistant Thick Film; Manufacturer_Name: YAGEO; Manufacturer_Part_Number: RC0402FR-0710KL; Datasheet Link: https://componentsearchengine.com/Datasheets/2/RC0402FR-0710KL.pdf; Height: 0.4mm; Mouser Part Number: 603-RC0402FR-0710KL; Mouser Price/Stock: https://www.mouser.co.uk/ProductDetail/YAGEO/RC0402FR-0710KL?qs=I1mnnYJTTsxUoNwrUsQExA%3D%3D; Arrow Part Number: RC0402FR-0710KL; Arrow Price/Stock: https://www.arrow.com/en/products/rc0402fr-0710kl/yageo?region=europe; Manu Part #: RC0402FR-0722K1L; LCSC Part #: C163478

## Sheet Motor Driver.SchDoc
size B; SheetNumber: 3; SheetTotal: 4
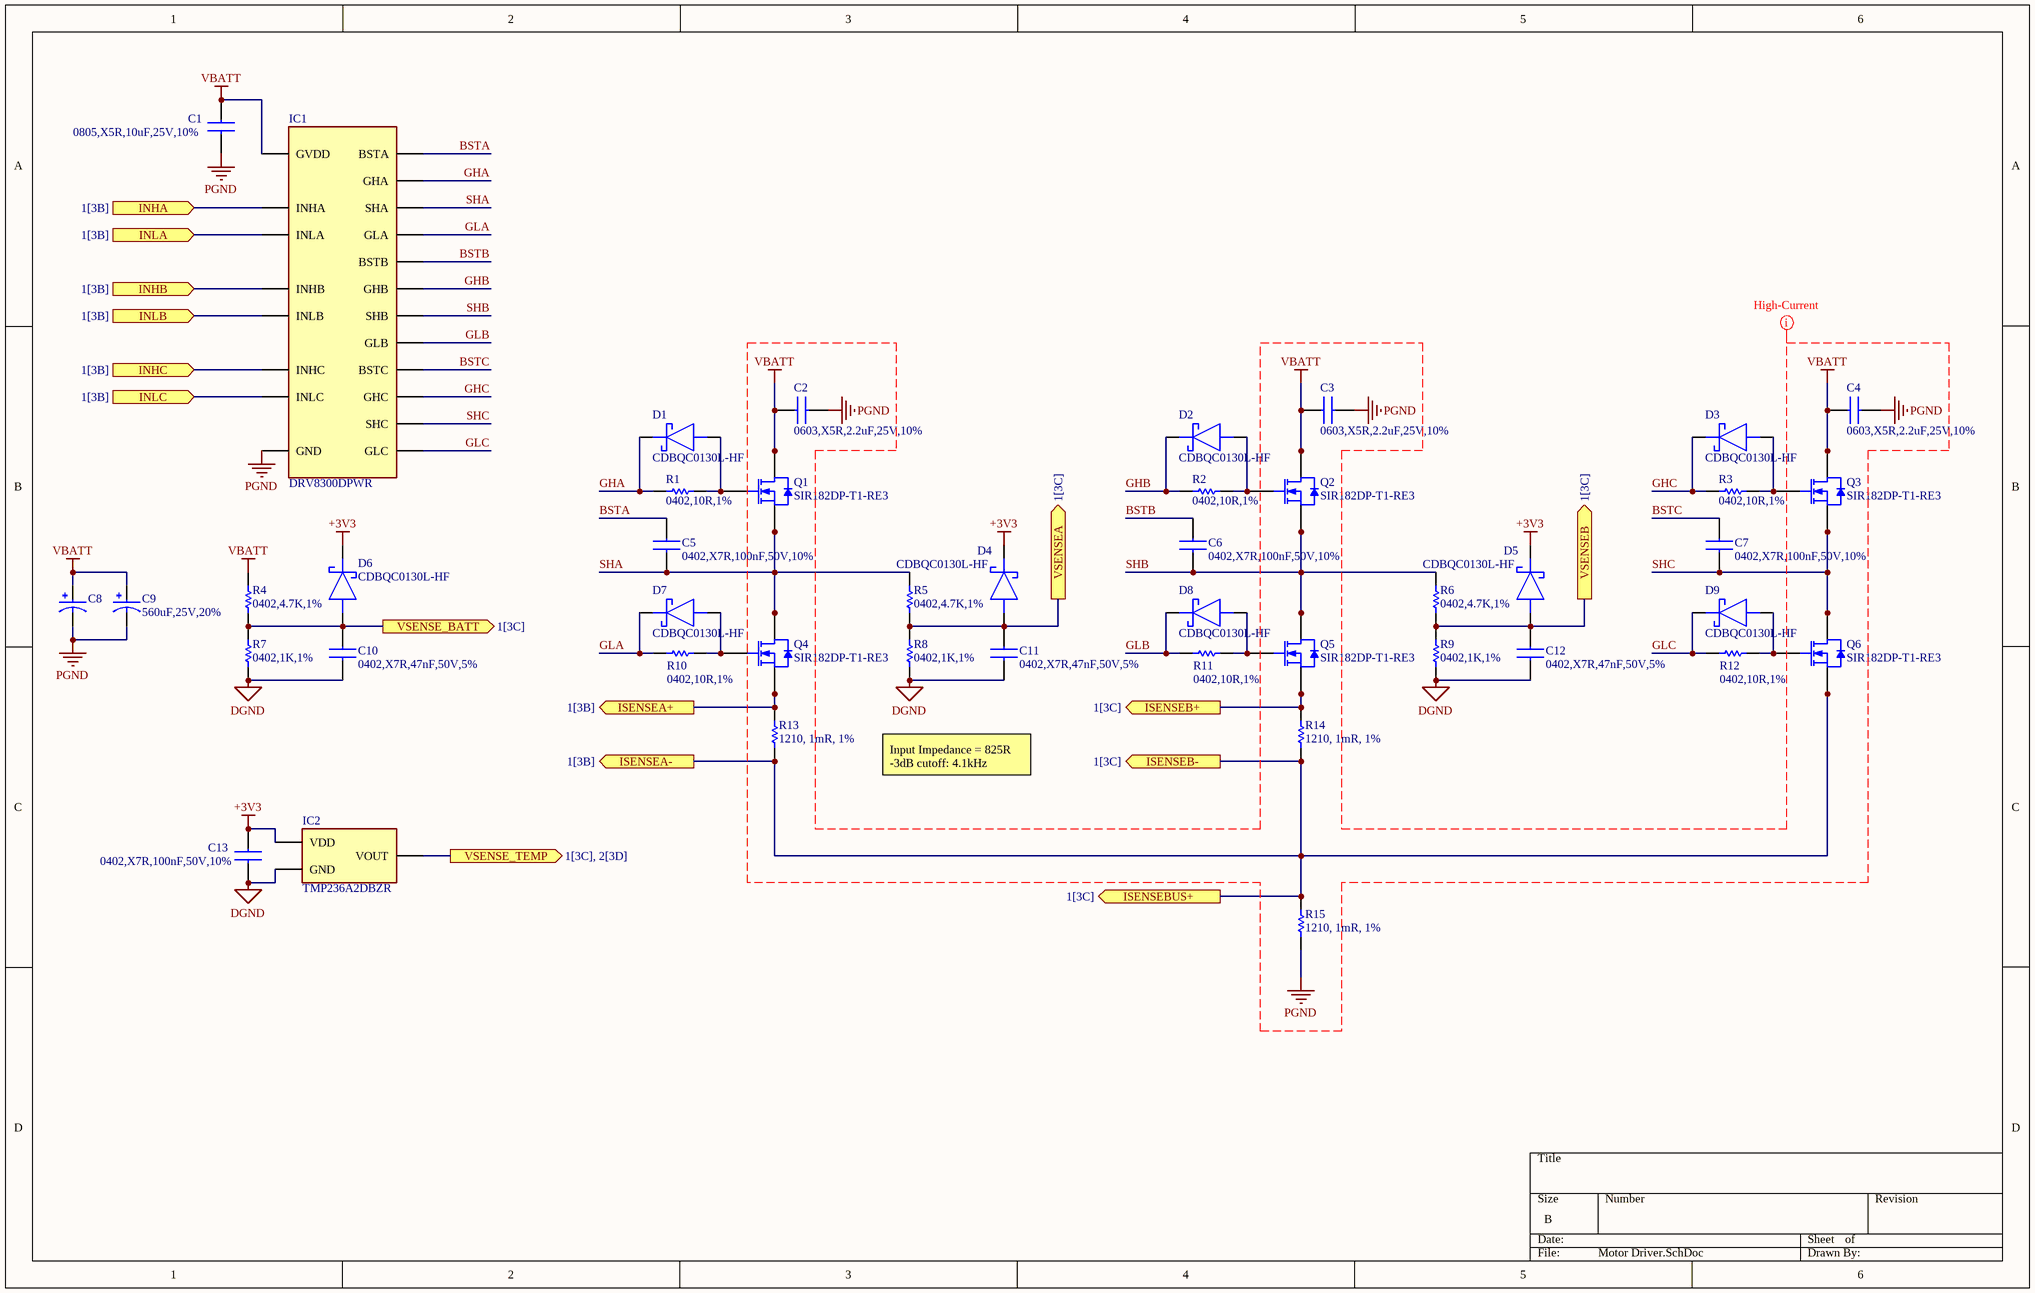
[diagram p3: Motor Driver.SchDoc]

### Parts
C1  0805,X5R,10uF,25V,10%  [CAPC2012X145N]
C2  0603,X5R,2.2uF,25V,10%  [CAPC1608X90N]
C3  0603,X5R,2.2uF,25V,10%  [CAPC1608X90N]
C4  0603,X5R,2.2uF,25V,10%  [CAPC1608X90N]
C5  0402,X7R,100nF,50V,10%  [CAPC1005X55N]
C6  0402,X7R,100nF,50V,10%  [CAPC1005X55N]
C7  0402,X7R,100nF,50V,10%  [CAPC1005X55N]
C8  560uF,25V,20%  [CAP-SMD_BD8.0-L8.3-W8.3-FD]  (value not drawn)
C9  560uF,25V,20%  [CAP-SMD_BD8.0-L8.3-W8.3-FD]
C10  0402,X7R,47nF,50V,5%  [CAPC1005X55N]
C11  0402,X7R,47nF,50V,5%  [CAPC1005X55N]
C12  0402,X7R,47nF,50V,5%  [CAPC1005X55N]
C13  0402,X7R,100nF,50V,10%  [CAPC1005X55N]
D1  CDBQC0130L-HF  [CDBQC0130LHF]
D2  CDBQC0130L-HF  [CDBQC0130LHF]
D3  CDBQC0130L-HF  [CDBQC0130LHF]
D4  CDBQC0130L-HF  [CDBQC0130LHF]
D5  CDBQC0130L-HF  [CDBQC0130LHF]
D6  CDBQC0130L-HF  [CDBQC0130LHF]
D7  CDBQC0130L-HF  [CDBQC0130LHF]
D8  CDBQC0130L-HF  [CDBQC0130LHF]
D9  CDBQC0130L-HF  [CDBQC0130LHF]
IC1  DRV8300DPWR  [SOP65P640X120-20N]
IC2  TMP236A2DBZR  [SOT95P237X112-3N]
Q1  SIR182DP-T1-RE3  [POWERPAK-SO-8_L5.9-W4.9-P1.27-LS6.2-BL]
Q2  SIR182DP-T1-RE3  [POWERPAK-SO-8_L5.9-W4.9-P1.27-LS6.2-BL]
Q3  SIR182DP-T1-RE3  [POWERPAK-SO-8_L5.9-W4.9-P1.27-LS6.2-BL]
Q4  SIR182DP-T1-RE3  [POWERPAK-SO-8_L5.9-W4.9-P1.27-LS6.2-BL]
Q5  SIR182DP-T1-RE3  [POWERPAK-SO-8_L5.9-W4.9-P1.27-LS6.2-BL]
Q6  SIR182DP-T1-RE3  [POWERPAK-SO-8_L5.9-W4.9-P1.27-LS6.2-BL]
R1  0402,10R,1%  [RESC1005X40N]
R2  0402,10R,1%  [RESC1005X40N]
R3  0402,10R,1%  [RESC1005X40N]
R4  0402,4.7K,1%  [RESC1005X40N]
R5  0402,4.7K,1%  [RESC1005X40N]
R6  0402,4.7K,1%  [RESC1005X40N]
R7  0402,1K,1%  [RESC1005X40N]
R8  0402,1K,1%  [RESC1005X40N]
R9  0402,1K,1%  [RESC1005X40N]
R10  0402,10R,1%  [RESC1005X40N]
R11  0402,10R,1%  [RESC1005X40N]
R12  0402,10R,1%  [RESC1005X40N]
R13  1210, 1mR, 1%  [R1210]
R14  1210, 1mR, 1%  [R1210]
R15  1210, 1mR, 1%  [R1210]

### Ports
INHA (in, see 1[3B]), INHB (in, see 1[3B]), INHC (in, see 1[3B]), INLA (in, see 1[3B]), INLB (in, see 1[3B]), INLC (in, see 1[3B]), ISENSEA+ (out, see 1[3B]), ISENSEA- (out, see 1[3B]), ISENSEB+ (out, see 1[3C]), ISENSEB- (out, see 1[3C]), ISENSEBUS+ (out, see 1[3C]), VSENSE_BATT (out, see 1[3C]), VSENSE_TEMP (out, see 1[3C], 2[3D]), VSENSEA (out, see 1[3C]), VSENSEB (out, see 1[3C])

### Nets
+3V3: C13.2 D4.1(K) D5.1(K) D6.1(K) IC2.1(VDD)
DGND: C10.1 C11.1 C12.1 C13.1 IC2.3(GND) R7.1 R8.1 R9.1
PGND: C1.2 C2.2 C3.2 C4.2 C8.2 C9.2 IC1.8(GND) R15.1
VBATT: C1.1 C2.1 C3.1 C4.1 C8.1 C9.1 IC1.7(GVDD) Q1.5(D) Q1.6(D) Q1.7(D) Q1.8(D) Q2.5(D) Q2.6(D) Q2.7(D) Q2.8(D) Q3.5(D) Q3.6(D) Q3.7(D) Q3.8(D) R4.2
ADC1_IN10: C11.2 D4.2(A) R5.1 R8.2 ; port VSENSEA
ADC1_IN14: C10.2 D6.2(A) R4.1 R7.2 ; port VSENSE_BATT
ADC2_IN12: C12.2 D5.2(A) R6.1 R9.2 ; port VSENSEB
ADC2_IN17: IC2.2(VOUT) ; port VSENSE_TEMP
BSTA: C5.2 IC1.20(BSTA)
BSTB: C6.2 IC1.17(BSTB)
BSTC: C7.2 IC1.14(BSTC)
GHA: D1.1(K) IC1.19(GHA) R1.1
GHB: D2.1(K) IC1.16(GHB) R2.1
GHC: D3.1(K) IC1.13(GHC) R3.1
GLA: D7.1(K) IC1.11(GLA) R10.1
GLB: D8.1(K) IC1.10(GLB) R11.1
GLC: D9.1(K) IC1.9(GLC) R12.1
SHA: C5.1 IC1.18(SHA) Q1.1(S) Q1.2(S) Q1.3(S) Q4.5(D) Q4.6(D) Q4.7(D) Q4.8(D) R5.2
SHB: C6.1 IC1.15(SHB) Q2.1(S) Q2.2(S) Q2.3(S) Q5.5(D) Q5.6(D) Q5.7(D) Q5.8(D) R6.2
SHC: C7.1 IC1.12(SHC) Q3.1(S) Q3.2(S) Q3.3(S) Q6.5(D) Q6.6(D) Q6.7(D) Q6.8(D)
TIM1_CH1: IC1.1(INHA) ; port INHA
TIM1_CH1N: IC1.2(INHB) ; port INHB
TIM1_CH2: IC1.3(INHC) ; port INHC
TIM1_CH2N: IC1.4(INLA) ; port INLA
TIM1_CH3: IC1.5(INLB) ; port INLB
TIM1_CH3N: IC1.6(INLC) ; port INLC
NetD1_2: D1.2(A) Q1.4(G) R1.2
NetD2_2: D2.2(A) Q2.4(G) R2.2
NetD3_2: D3.2(A) Q3.4(G) R3.2
NetD7_2: D7.2(A) Q4.4(G) R10.2
NetD8_2: D8.2(A) Q5.4(G) R11.2
NetD9_2: D9.2(A) Q6.4(G) R12.2
NetQ4_1: Q4.1(S) Q4.2(S) Q4.3(S) R13.2 ; port ISENSEA+
NetQ5_1: Q5.1(S) Q5.2(S) Q5.3(S) R14.2 ; port ISENSEB+
NetQ6_1: Q6.1(S) Q6.2(S) Q6.3(S) R13.1 R14.1 R15.2 ; port ISENSEA-, port ISENSEB-, port ISENSEBUS+

### Layout directives
net class High-Current: PGND, VBATT

### Notes on the sheet
- Input Impedance = 825R
  -3dB cutoff: 4.1kHz

### Library data of the parts
C1 = CC0805KKX5R8BB106: as C16 on sheet STM32G4; Datasheet Link: https://www.yageo.com/upload/media/product/productsearch/datasheet/mlcc/UPY-GPHC_X5R_4V-to-50V_27.pdf; Height: 1.45mm; Manufacturer_Part_Number: CC0805KKX5R8BB106; Mouser Part Number: 603-CC805KKX5R8BB106; Mouser Price/Stock: https://www.mouser.co.uk/ProductDetail/YAGEO/CC0805KKX5R8BB106?qs=57cj7OiSijm89pM64t1AGQ%3D%3D; Arrow Part Number: CC0805KKX5R8BB106; Arrow Price/Stock: https://www.arrow.com/en/products/cc0805kkx5r8bb106/yageo?utm_currency=USD&region=nac; LCSC Part #: C89831
C2-C4 = CC0603KRX5R8BB225: 2.2 µF ±10% 25V Ceramic Capacitor X5R 0603 (1608 Metric); Manufacturer_Name: YAGEO; Manufacturer_Part_Number: CC0603JRNPO9BN560; Datasheet Link: https://www.yageo.com/upload/media/product/app/datasheet/mlcc/upy-gphc_x7r_6_3v-to-250v.pdf; Height: 0.95mm; Mouser Part Number: 603-CC603KRX7R9BB105; Mouser Price/Stock: https://www.mouser.co.uk/ProductDetail/YAGEO/CC0603KRX7R9BB105?qs=6wERJjOp3mmF17%252BYi8cgJQ%3D%3D; Arrow Part Number: CC0603KRX7R9BB105; Arrow Price/Stock: https://www.arrow.com/en/products/cc0603krx7r9bb105/yageo?utm_currency=USD&region=nac; LCSC Part #: C309478; Manu Part #: CC0603KRX5R8BB225
C5-C7 C13 = CC0402KRX7R9BB104: as C15 on sheet STM32G4; Datasheet Link: https://4donline.ihs.com/images/VipMasterIC/IC/YAGO/YAGO-S-A0003557223/YAGO-S-A0003557223-1.pdf?hkey=6D3A4C79FDBF58556ACFDE234799DDF0; Height: 0.55mm; Manufacturer_Part_Number: CC0402KRX7R9BB104; Mouser Part Number: 603-CC402KRX7R9BB104; Mouser Price/Stock: https://www.mouser.co.uk/ProductDetail/YAGEO/CC0402KRX7R9BB104?qs=vRUrOTOuwyGrQb4GbTIVjw%3D%3D; Arrow Part Number: CC0402KRX7R9BB104; Arrow Price/Stock: https://www.arrow.com/en/products/cc0402krx7r9bb104/yageo?utm_currency=USD&region=europe; Manu Part #: CC0402KRX7R9BB104; LCSC Part #: C131394
C8 C9 = HV1E567M0810PZ: 25V 560uF ±20% SMD,D8xL10.5mm Aluminum - Polymer Capacitors RoHS; LCSC Part #: C5246548; Manu Part #: HV1E567M0810PZ
C10-C12 = CC0402JRX7R9BB473: as C25 on sheet Buck; Datasheet Link: https://4donline.ihs.com/images/VipMasterIC/IC/YAGO/YAGO-S-A0003557223/YAGO-S-A0003557223-1.pdf?hkey=6D3A4C79FDBF58556ACFDE234799DDF0; Height: 0.55mm; Manufacturer_Part_Number: CC0402JRX7R9BB473; Mouser Part Number: 603-CC402KRX7R9BB104; Mouser Price/Stock: https://www.mouser.co.uk/ProductDetail/YAGEO/CC0402KRX7R9BB104?qs=vRUrOTOuwyGrQb4GbTIVjw%3D%3D; Arrow Part Number: CC0402KRX7R9BB104; Arrow Price/Stock: https://www.arrow.com/en/products/cc0402krx7r9bb104/yageo?utm_currency=USD&region=europe; Manu Part #: CC0402JRX7R9BB473; LCSC Part #: C576715
D1-D9 = CDBQC0130L-HF: Diode 30 V 100mA Surface Mount 0402C/SOD-923F; Manufacturer_Name: Comchip Technology; Datasheet Link: https://www.comchiptech.com/admin/files/product/CDBQC0130L-HF%20RevB681116.pdf; Height: 0.55mm; Manufacturer_Part_Number: CDBQC0130L-HF; Mouser Part Number: 750-CDBQC0130L-HF; Mouser Price/Stock: https://www.mouser.co.uk/ProductDetail/Comchip-Technology/CDBQC0130L-HF?qs=YlpJWyuQ3PMlIcuiqEd%2FoA%3D%3D; Arrow Part Number: CDBQC0130L-HF; Arrow Price/Stock: https://www.arrow.com/en/products/cdbqc0130l-hf/comchip-technology?utm_currency=USD&region=nac; Manu Part #: CDBQC0130L-HF; LCSC Part #: C2886012
IC1 = DRV8300DPWR: TSSOP-20 Brushless DC (BLDC) Motor Driver ROHS; Manufacturer_Name: Texas Instruments; Height: 1.2mm; Manufacturer_Part_Number: DRV8300DPWR; Mouser Part Number: 595-DRV8300DPWR; Mouser Price/Stock: https://www.mouser.co.uk/ProductDetail/Texas-Instruments/DRV8300DPWR?qs=eP2BKZSCXI6qJbKdYnGwBg%3D%3D; Arrow Part Number: DRV8300DPWR; Arrow Price/Stock: https://www.arrow.com/en/products/drv8300dpwr/texas-instruments?utm_currency=USD&region=nac; LCSC Part #: C3036056
IC2 = TMP236A2DBZR: Low-power and high-precision analog output temperature sensor; Manufacturer_Name: Texas Instruments; Datasheet Link: http://www.ti.com/lit/gpn/tmp236; Height: 1.12mm; Manufacturer_Part_Number: TMP236A2DBZR; Mouser Part Number: 595-TMP236A2DBZR; Mouser Price/Stock: https://www.mouser.co.uk/ProductDetail/Texas-Instruments/TMP236A2DBZR?qs=lc2O%252BfHJPVanftlPgPUvow%3D%3D; Arrow Part Number: TMP236A2DBZR; Arrow Price/Stock: https://www.arrow.com/en/products/tmp236a2dbzr/texas-instruments?region=nac; LCSC Part #: C2859666
Q1-Q6 = SIR182DP-T1-RE3: 60V 117A 2.8mΩ@10V,15A 2V 1 N-Channel PowerPAKSO-8 MOSFETs ROHS; LCSC Part #: C467943
R1-R3 R10-R12 = RC0402FR-0710RL: 10 Ohms ±1% 0.063W, 1/16W Chip Resistor 0402 (1005 Metric) Moisture Resistant Thick Film; Manufacturer_Name: YAGEO; Manufacturer_Part_Number: RC0402FR-0710KL; Datasheet Link: https://componentsearchengine.com/Datasheets/2/RC0402FR-0710KL.pdf; Height: 0.4mm; Mouser Part Number: 603-RC0402FR-0710KL; Mouser Price/Stock: https://www.mouser.co.uk/ProductDetail/YAGEO/RC0402FR-0710KL?qs=I1mnnYJTTsxUoNwrUsQExA%3D%3D; Arrow Part Number: RC0402FR-0710KL; Arrow Price/Stock: https://www.arrow.com/en/products/rc0402fr-0710kl/yageo?region=europe; Manu Part #: RC0402FR-0710RL; LCSC Part #: C138066
R4-R6 = RC0402FR-074K7L: 4.7 kOhms ±1% 0.063W, 1/16W Chip Resistor 0402 (1005 Metric) Moisture Resistant Thick Film; Manufacturer_Name: YAGEO; Manufacturer_Part_Number: RC0402FR-0710KL; Datasheet Link: https://componentsearchengine.com/Datasheets/2/RC0402FR-0710KL.pdf; Height: 0.4mm; Mouser Part Number: 603-RC0402FR-0710KL; Mouser Price/Stock: https://www.mouser.co.uk/ProductDetail/YAGEO/RC0402FR-0710KL?qs=I1mnnYJTTsxUoNwrUsQExA%3D%3D; Arrow Part Number: RC0402FR-0710KL; Arrow Price/Stock: https://www.arrow.com/en/products/rc0402fr-0710kl/yageo?region=europe; Manu Part #: RC0402FR-074K7L; LCSC Part #: C105871
R7-R9 = RC0402FR-071KL: as R17 on sheet STM32G4; Datasheet Link: https://componentsearchengine.com/Datasheets/2/RC0402FR-0710KL.pdf; Height: 0.4mm; Mouser Part Number: 603-RC0402FR-0710KL; Mouser Price/Stock: https://www.mouser.co.uk/ProductDetail/YAGEO/RC0402FR-0710KL?qs=I1mnnYJTTsxUoNwrUsQExA%3D%3D; Arrow Part Number: RC0402FR-0710KL; Arrow Price/Stock: https://www.arrow.com/en/products/rc0402fr-0710kl/yageo?region=europe; Manu Part #: RC0402FR-071KL; LCSC Part #: C106235
R13-R15 = PMR25HZPFV1L00: 1W 1mΩ Current Sense Resistor ±100ppm/℃ ±1% 1210 Current Sense Resistors / Shunt Resistors ROHS; LCSC Part #: C509735

## Nets that join several sheets
+3V3: STM32G4 (13 pins), Buck (6 pins), Motor Driver (5 pins)
DGND: Top Level (J2.1), STM32G4 (19 pins), Buck (R38.2), Motor Driver (8 pins)
PGND: STM32G4 (R29.1), Buck (20 pins), Motor Driver (8 pins)
VBATT: Buck (D13.2), Motor Driver (20 pins)
ADC1_IN10: STM32G4 (IC3.5), Motor Driver (C11.2 D4.2 R5.1 R8.2)
ADC1_IN14: STM32G4 (IC3.25), Motor Driver (C10.2 D6.2 R4.1 R7.2)
ADC2_IN12: STM32G4 (IC3.18), Motor Driver (C12.2 D5.2 R6.1 R9.2)
ADC2_IN17: STM32G4 (IC3.12), Motor Driver (IC2.2)
NetQ4_1: STM32G4 (R20.1), Motor Driver (Q4.1 Q4.2 Q4.3 R13.2)
NetQ5_1: STM32G4 (R25.1), Motor Driver (Q5.1 Q5.2 Q5.3 R14.2)
NetQ6_1: STM32G4 (R17.1 R23.1 R31.1), Motor Driver (6 pins)
TIM1_CH1: STM32G4 (IC3.30), Motor Driver (IC1.1)
TIM1_CH1N: STM32G4 (IC3.2), Motor Driver (IC1.2)
TIM1_CH2: STM32G4 (IC3.31), Motor Driver (IC1.3)
TIM1_CH2N: STM32G4 (IC3.28), Motor Driver (IC1.4)
TIM1_CH3: STM32G4 (IC3.32), Motor Driver (IC1.5)
TIM1_CH3N: STM32G4 (IC3.29), Motor Driver (IC1.6)
USART1_RX: Top Level (J2.3), STM32G4 (IC3.44)
USART1_TX: Top Level (J2.2), STM32G4 (IC3.43)
USB_D_N: STM32G4 (IC3.33), Buck (D12.6 J3.A7 J3.B7)
USB_D_P: STM32G4 (IC3.34), Buck (D12.1 J3.A6 J3.B6)